# Altium schematic sheet 7segLED.SchDoc
size A4; SheetNumber: 4; SheetTotal: 4
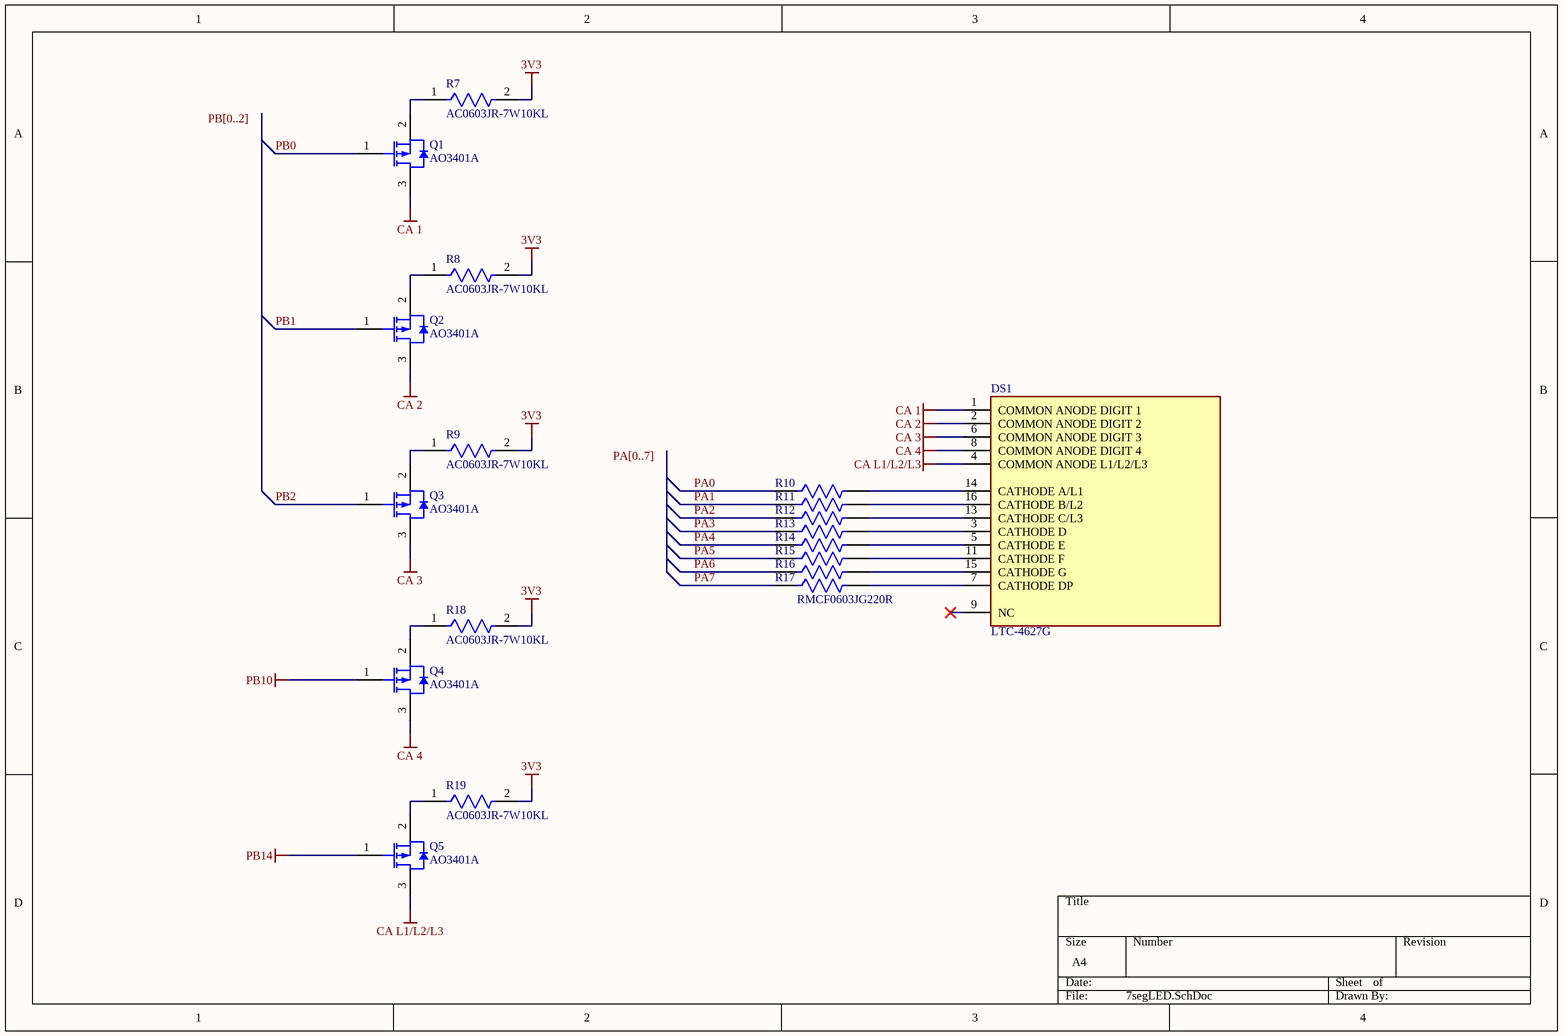
[diagram p0: 7segLED.SchDoc]

## Parts
DS1  LTC-4627G  [FP-LTC-4627G-MFG]
Q1  AO3401A  [AO-SOT-23-3L_V]
Q2  AO3401A  [AO-SOT-23-3L_V]
Q3  AO3401A  [AO-SOT-23-3L_V]
Q4  AO3401A  [AO-SOT-23-3L_V]
Q5  AO3401A  [AO-SOT-23-3L_V]
R7  AC0603JR-7W10KL  [FP-AC0603-IPC_A]
R8  AC0603JR-7W10KL  [FP-AC0603-IPC_A]
R9  AC0603JR-7W10KL  [FP-AC0603-IPC_A]
R10  RMCF0603JG220R  [FP-RMCF0603-MFG]  (value not drawn)
R11  RMCF0603JG220R  [FP-RMCF0603-MFG]  (value not drawn)
R12  RMCF0603JG220R  [FP-RMCF0603-MFG]  (value not drawn)
R13  RMCF0603JG220R  [FP-RMCF0603-MFG]  (value not drawn)
R14  RMCF0603JG220R  [FP-RMCF0603-MFG]  (value not drawn)
R15  RMCF0603JG220R  [FP-RMCF0603-MFG]  (value not drawn)
R16  RMCF0603JG220R  [FP-RMCF0603-MFG]  (value not drawn)
R17  RMCF0603JG220R  [FP-RMCF0603-MFG]
R18  AC0603JR-7W10KL  [FP-AC0603-IPC_A]
R19  AC0603JR-7W10KL  [FP-AC0603-IPC_A]

## Nets
3V3: R7.2 R8.2 R9.2 R18.2 R19.2
CA 1: DS1.1(COMMON_ANODE_DIGIT_1) Q1.3(DRAIN)
CA 2: DS1.2(COMMON_ANODE_DIGIT_2) Q2.3(DRAIN)
CA 3: DS1.6(COMMON_ANODE_DIGIT_3) Q3.3(DRAIN)
CA 4: DS1.8(COMMON_ANODE_DIGIT_4) Q4.3(DRAIN)
CA L1/L2/L3: DS1.4(COMMON_ANODE_L1/L2/L3) Q5.3(DRAIN)
PB10: Q4.1(GATE)
PB14: Q5.1(GATE)
PA0: R10.1
PA1: R11.1
PA2: R12.1
PA3: R13.1
PA4: R14.1
PA5: R15.1
PA6: R16.1
PA7: R17.1
PB0: Q1.1(GATE)
PB1: Q2.1(GATE)
PB2: Q3.1(GATE)
NetDS1_3: DS1.3(CATHODE_D) R13.2
NetDS1_5: DS1.5(CATHODE_E) R14.2
NetDS1_7: DS1.7(CATHODE_DP) R17.2
NetDS1_11: DS1.11(CATHODE_F) R15.2
NetDS1_13: DS1.13(CATHODE_C/L3) R12.2
NetDS1_14: DS1.14(CATHODE_A/L1) R10.2
NetDS1_15: DS1.15(CATHODE_G) R16.2
NetDS1_16: DS1.16(CATHODE_B/L2) R11.2
NetQ1_2: Q1.2(SOURCE) R7.1
NetQ2_2: Q2.2(SOURCE) R8.1
NetQ3_2: Q3.2(SOURCE) R9.1
NetQ4_2: Q4.2(SOURCE) R18.1
NetQ5_2: Q5.2(SOURCE) R19.1

Not connected (* = marked no-connect by the designer): DS1 9(NC)*

## Buses and harness runs
bus PA[0..7]
bus PB[0..2]

## Notes on the sheet
- Labels drawn without touching a wire or pin: PA[0..7], PB[0..2]

## Library data of the parts
DS1 = CMP-2000-06610-2: LED 7-SEG 4DIGIT GRN 0.4" CA; Manufacturer: Lite-On; Test Current: 20mA; Luminous Intensity: 2.2mcd; Wavelength: 569nm; Power Dissipation: 75mW; Element Config: Common Anode; Reverse Voltage: 5V; Forward Voltage: 2.1V; Temperature Range Low: -35°C; Lead Free: Yes; Manufacturer Part Number: LTC-4627G; Height: 7.25mm; Package: 0; Device Class L1: Optoelectronics; Category: Disp; Mouser Description: LED Displays & Accessories 4 Digit, Green; Display Type: LED; Forward Current: 20mA; Device Class L2: Displays; Device Class L3: LED Displays; ComponentLink2Description: Datasheet; Octopart: https://octopart.com/ltc-4627g-lite-on-8442722; ComponentLink2URL: https://datasheet.ciiva.com/15136/getdatasheetpartid-630597-15136600.pdf; Automotive: No; Temperature: -35°C to +85°C; RoHS: TRUE; Temperature Range High: +85°C; Digikey Description: LED 7-SEG 4DIGIT GRN 0.4" CA
Q1-Q5 = CMP-2000-05778-1: P-Channel MOSFET, 30 V, 4 A, -55 to 150 degC, 3-Pin SOT-23-3L, RoHS, Tape and Reel; Manufacturer: Alpha and Omega; Output Power (Max): NotRequiredW; Power Dissipation: 1.4W; Rad Hardened: No; Drain Efficiency: NotRequired%; Drain-Source On-Volt: 30V; Noise Figure: NotRequireddB; Frequency (Max): NotRequiredMHz; Number of  Elements: 1; Gate-Source Voltage (Max): ?12V; Drain Current (Max): 4A; Channel Mode: Enhancement; Drain-Source On-Res: 0.044ohm; Type: PowerMOSFET; Polarity: P; Package URL: http://www.aosmd.com/res/packaging_information/SOT-23-3L.pdf; Datasheet URL: http://www.aosmd.com/res/data_sheets/AO3401A.pdf; Package Type: SOT-23; Package Description: 3-Pin Small Outline Transistor, Body 2.95 x 1.6 mm, Pitch 0.95 mm; Mounting: SurfaceMount; Manufacturer URL: http://www.aosmd.com/; Continuous Drain Current: 4A; Package Reference: SOT-23-3L; Mounting Technology: SurfaceMount; Operating Temperature Classification: Military; Power Gain: NotRequireddB; Datasheet Version: Rev. 3, 03/2011; Operating Temp Range: -55Cto150C; Pin Count: 3
R7-R9 R18 R19 = CMP-03412-040683-1: RES 10kΩ 5.00% 0.2W 0603
R10-R17 = CMP-26527-002055-1: 220Ω ±5% 0.1W 0603 Thick Film Chip Resistor AEC-Q200 compliant; Resistance: 220R; Temperature Coefficient: 100ppm/°C; Min Operating Temperature: -55°C; Contact Plating: Tin; Max Operating Temperature: 155°C; Radiation Hardening: No; Tolerance: 5%; RoHS Compliant: Yes; Packaging: Tape and Reel; Mount: Surface Mount; Case/Package: 0603; Resistor Type: Thick Film